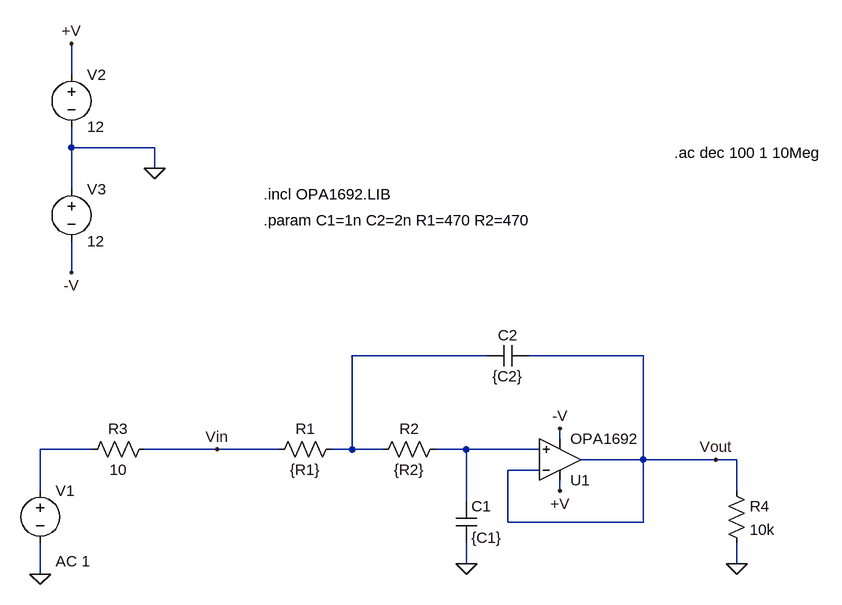
[diagram p0: schematic lowpass v1.asc]
lowpass v1.asc, the LTspice schematic file:
Version 4
SHEET 1 880 724
WIRE -304 -64 -304 -112
WIRE -304 48 -304 16
WIRE -176 48 -304 48
WIRE -176 80 -176 48
WIRE -304 112 -304 48
WIRE -304 240 -304 192
WIRE 336 368 128 368
WIRE 576 368 400 368
WIRE 448 496 448 480
WIRE -272 512 -352 512
WIRE -80 512 -192 512
WIRE 16 512 -80 512
WIRE 128 512 128 368
WIRE 128 512 96 512
WIRE 176 512 128 512
WIRE 304 512 256 512
WIRE 416 512 304 512
WIRE 576 528 576 368
WIRE 576 528 480 528
WIRE 688 528 576 528
WIRE 720 528 688 528
WIRE 416 544 368 544
WIRE -352 576 -352 512
WIRE 448 576 448 560
WIRE 720 576 720 528
WIRE 304 592 304 512
WIRE 368 624 368 544
WIRE 576 624 576 528
WIRE 576 624 368 624
WIRE 304 688 304 656
WIRE 720 688 720 656
WIRE -352 704 -352 656
FLAG 304 688 0
FLAG -352 704 0
FLAG -80 512 Vin
FLAG 720 688 0
FLAG -176 80 0
FLAG -304 -112 +V
FLAG -304 240 -V
FLAG 448 480 -V
FLAG 448 576 +V
FLAG 688 528 Vout
SYMBOL OpAmps\\opamp2 448 592 M180
SYMATTR InstName U1
SYMATTR Value OPA1692
SYMBOL res 112 496 R90
WINDOW 0 0 56 VBottom 2
WINDOW 3 32 56 VTop 2
SYMATTR InstName R1
SYMATTR Value {R1}
SYMBOL res 272 496 R90
WINDOW 0 0 56 VBottom 2
WINDOW 3 32 56 VTop 2
SYMATTR InstName R2
SYMATTR Value {R2}
SYMBOL cap 288 592 R0
SYMATTR InstName C1
SYMATTR Value {C1}
SYMBOL cap 400 352 R90
WINDOW 0 0 32 VBottom 2
WINDOW 3 32 32 VTop 2
SYMATTR InstName C2
SYMATTR Value {C2}
SYMBOL voltage -352 560 R0
WINDOW 123 24 124 Left 2
WINDOW 39 0 0 Left 0
SYMATTR InstName V1
SYMATTR Value ""
SYMATTR Value2 AC 1
SYMBOL res -176 496 R90
WINDOW 0 0 56 VBottom 2
WINDOW 3 32 56 VTop 2
SYMATTR InstName R3
SYMATTR Value 10
SYMBOL res 704 560 R0
SYMATTR InstName R4
SYMATTR Value 10k
SYMBOL voltage -304 -80 R0
WINDOW 123 0 0 Left 0
WINDOW 39 0 0 Left 0
SYMATTR InstName V2
SYMATTR Value 12
SYMBOL voltage -304 96 R0
WINDOW 123 0 0 Left 0
WINDOW 39 0 0 Left 0
SYMATTR InstName V3
SYMATTR Value 12
TEXT -8 120 Left 2 !.incl OPA1692.LIB
TEXT -8 160 Left 2 !.param C1=1n C2=2n R1=470 R2=470
TEXT 624 56 Left 2 !.ac dec 100 1 10Meg

The netlist it stands for:
* lowpass v1.asc
XU1 N003 Vout +V -V Vout OPA1692  ; pins In+ In- V+ V- OUT
R1 N001 Vin {R1}
R2 N003 N001 {R2}
C1 N003 0 {C1}
C2 Vout N001 {C2}
V1 N002 0 AC 1
R3 Vin N002 10
R4 Vout 0 10k
V2 +V 0 12
V3 0 -V 12
.incl OPA1692.LIB
.param C1=1n C2=2n R1=470 R2=470
.ac dec 100 1 10Meg
.backanno
.end